# EAGLE design Board_4_Buttons_WS-TASV_ SMD Plug (EAGLE 9.6.2)
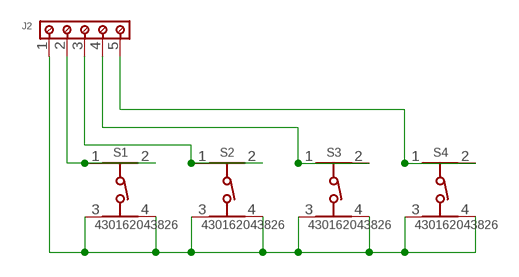
[diagram p0: schematic, sheet 1]

## Parts
J2  691709710305  [691709710305]
S1  430162043826  [430162043826]
S2  430162043826  [430162043826]
S3  430162043826  [430162043826]
S4  430162043826  [430162043826]

## Nets
N$1: J2.1 S1.3 S1.4 S2.3 S2.4 S3.3 S3.4 S4.3 S4.4
N$5: J2.2 S1.1 S1.2
N$6: J2.3 S2.1 S2.2
N$7: J2.4 S3.1 S3.2
N$8: J2.5 S4.1 S4.2

## Library data of the parts
J2 = Wurth_Connectors_WR-TBL Rising Cage Clamp:691709710305: WR-TBL Series 7097 - Rising Cage Clamp 5.0mm pitch - Horizontal cable entry - SMT Kind Properties Pitch 5 mm General Information Operating Temperature -40 up to +130 °C Compliance RoHS Electrical Properties IR cULus 6 A Working Voltage [cULus] 300 V (AC) Withstanding Voltage [cULus] 1600 V (AC) Contact Resistance [cULus] 20 mΩ Mechanical Properties Wire Strip Length 7 up to 8 (mm) Screw M3 Material Properties Insulator Material PA46 Insulator Flammability Rating UL94 V-0 Pin Material Brass Pin Plating Tin over Nickel Cage Material Brass Cage Plating Nickel Terminal Screw Material Steel Terminal Screw Plating Zinc Screw M3 Certification cULus Approval E315414 Packaging Properties Packaging Tape and Reel with Cap Wire Properties Wire Strip Length 7 up to 8 (mm) Solid Wire Section (AWG) 30 to 14 (AWG) Solid Wire Section (Metric) 0.2 to 1.5 (mm²) Stranded Wire Section (AWG) 30 to 14 (AWG) Stranded Wire Section (Metric) 0.2 to 1.5 (mm²) <https://www.we-online.com/components/media/o58289v209%20Family_WR-TBL_Serie_7097_6917097103xx.jpg> Details see: www.we-online.com/components/products/TBL_5_00_SMT_7097_HORIZONTAL_ENTRY_SMT_RISING_CAGE_CLAMP_69170971030X <www.we-online.com/catalog/TBL_5_00_SMT_7097_HORIZONTAL_ENTRY_SMT_RISING_CAGE_CLAMP_69170971030X/?utm_source=eagle_model&utm_medium=description_link&utm_campaign=eisos_eagle> Updated by Ella Wu 2023-08-23 2023(C) Wurth Elektronik; DATASHEET-URL: https://www.we-online.com/redexpert/spec/691709710305?ae; IR-UL: 6A; MOUNT: THT; PART-NUMBER: 691709710305; PINS: 5; PITCH: 5mm; TYPE: Horizontal; WIRE: 33 to 14 (AWG) 0.2 to 1.5 (mm²); WORKING-VOLTAGE-UL: 300V (AC)
S1-S4 = Wurth_Switch_WS-TASV:430162043826: WS-TASV SMT Tact Switch 12x12 mm Material Properties Cover Material : Stainless Steel Properties Actuator Material LCP Actuator Flammability Rating UL94 V-0 Actuator Color Black; White Frame Material PPA Frame Flammability Rating UL94 V-0 Frame Color Black Contact Material Stainless Steel Contact Plating Silver Terminal Material Copper Alloy Terminal Plating Silver VR 12 V (DC) Contact Resistance Initial 100 mΩ Contact Resistance After Life Test 2 Ω RISO 100 MΩ Withstanding Voltage 250 V (AC) Washable No Qty. 250; 400 Mechanical Properties Electrical Life:300000 Times; 500000 Times Stroke :0.3 mm General Information Operating Temperature:-40 up to +85 °C Washable:No Packaging Properties Packaging:Tape and Reel <https://www.we-online.com/catalog/media/o76676v209%20Family_WS-TASV-Gruppe.jpg> Details see: https://www.we-online.com/catalog/en/TASV_12X12_SMD/ Updated by yingchun,Shan;2020-02-20 2020(C) Würth Elektronik; DATASHEET-URL: https://www.we-online.com/redexpert/spec/430162043826?ae; HEIGHT: 4.3mm; OPERATION-FORCE: 260g; PART-NUMBER: 430162043826; QTY: 400

## Board
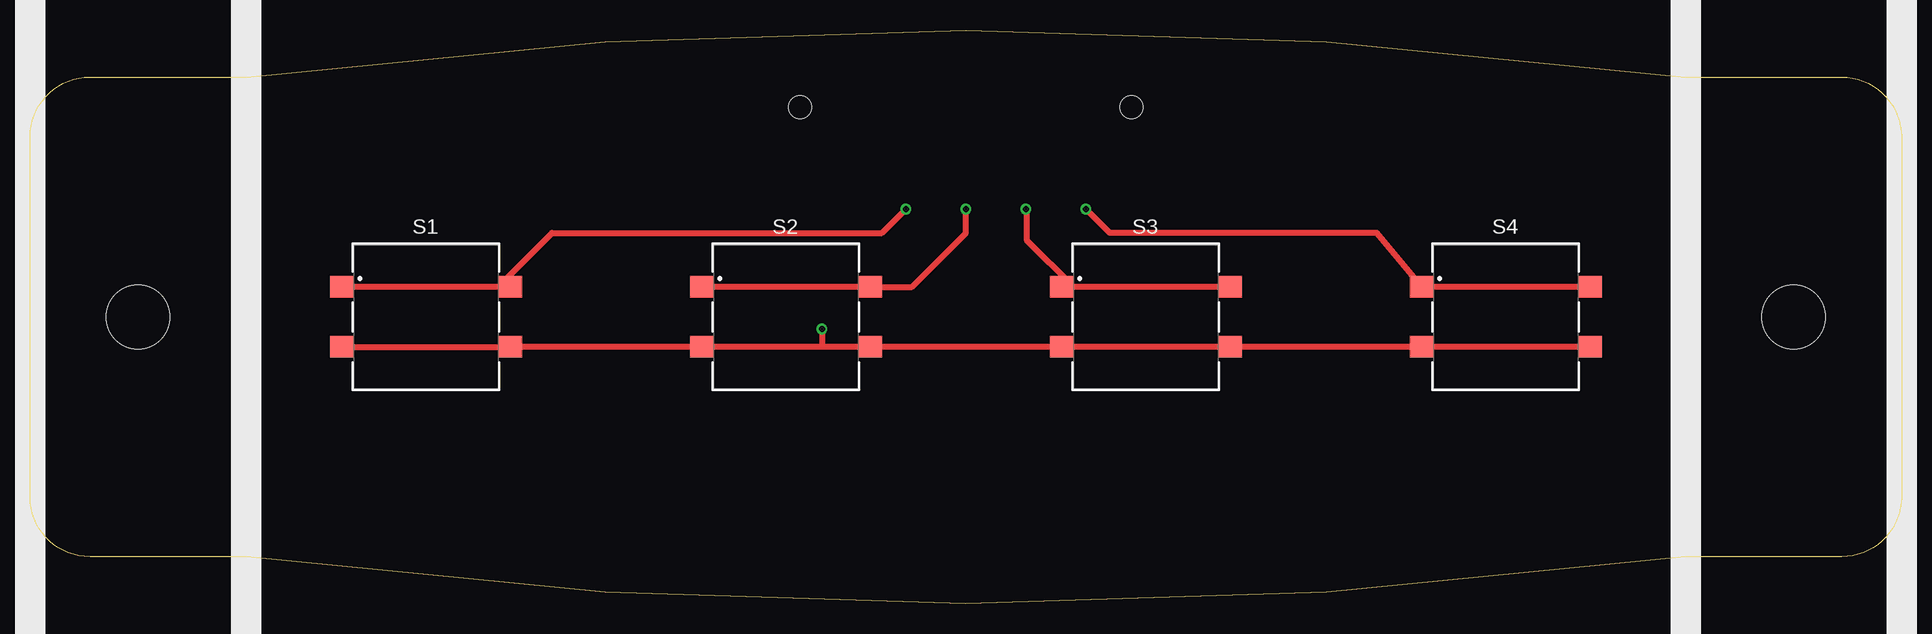
[diagram p1: board, top side]
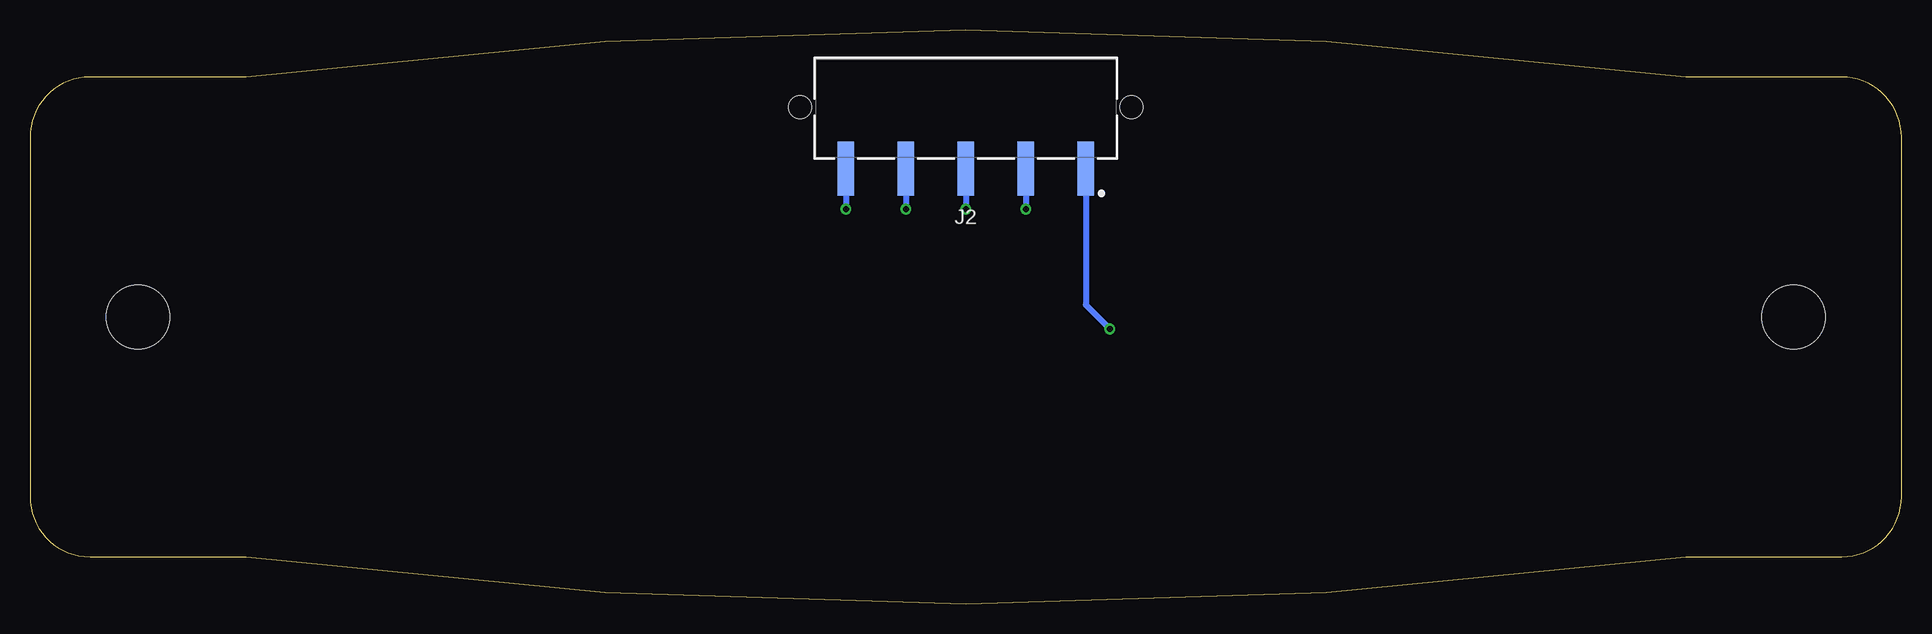
[diagram p2: board, bottom side, seen from below]

Size 156 x 47.87 mm. Coordinates in mm from the lower left corner, seen from the top.
Outline: 18,3.93 5,3.93 arc-90 0,8.93 0,38.93 arc-90 5,43.93 18,43.93 arc-15 138,43.93 151,43.93 arc-90 156,38.93 156,8.93 arc-90 151,3.93 138,3.93 arc-15 18,3.93
Copper layers (1*16): Top 0.035mm / dielectric 1.5mm / Bottom 0.035mm
Design rules "default *": minimum track width 6mil, minimum drill 0.35mm, track to track 6mil, track to pad 6mil, pad to pad 6mil, via to via 6mil, smd to smd 6mil, copper to edge 40mil, drill to drill 6mil, minimum pad ring 0.45mm, minimum via ring 8mil, stop-mask expansion 4mil, vias tented up to drill 2mm, thermal gap 10mil
Holes 5.3 mm at 9,23.93 147,23.93

### Footprints (pad centres in the part's own frame; a part is rotated, then mirrored left to right if it is on the bottom)
691709710305 = smd 1.4 x 4.5: 1 -10,5.15; 2 -5,5.15; 3 0,5.15; 4 5,5.15; 5 10,5.15 | hole 1.9: -13.8,0; 13.8,0
430162043826 = smd 2 x 1.8: 1 -7,2.5; 2 7,2.5; 3 -7,-2.5; 4 7,-2.5

### Placement (x,y rotation side)
J2  78,41.43 180 bottom
S1  33,23.93 0 top
S2  63,23.93 0 top
S3  93,23.93 0 top
S4  123,23.93 0 top

### Tracks (layer width: path | path; a pad name or v marks a point on that pad's centre or on a via)
N$1  (via drill 0.5)
  Top 0.508: S1.3 S1.4 S2.3 66,21.43 | 66,21.43 S2.4 S3.3 S3.4 S4.3 S4.4 | v66,22.93 66,21.43
  Bottom 0.508: v66,22.93 68,24.93 J2.1
N$5  (via drill 0.5)
  Top 0.508: S1.2 39,26.43 | 39,26.43 S1.1 | 39,26.43 43.5,30.93 71,30.93 v73,32.93
  Bottom 0.508: J2.2 v73,32.93
N$6  (via drill 0.5)
  Top 0.508: S2.1 S2.2 73.5,26.43 78,30.93 v78,32.93
  Bottom 0.508: J2.3 v78,32.93
N$7  (via drill 0.5)
  Top 0.508: S3.2 87,26.43 | 87,26.43 S3.1 | 87,26.43 83.08,30.35 83.08,32.85 v83,32.93
  Bottom 0.508: J2.4 v83,32.93
N$8  (via drill 0.5)
  Top 0.508: S4.2 S4.1 112.25,30.93 90,30.93 v88,32.93
  Bottom 0.508: J2.5 v88,32.93